# EAGLE design airball_sensor_board_v6 (EAGLE 9.4.2)

## Sheet 1 of 3
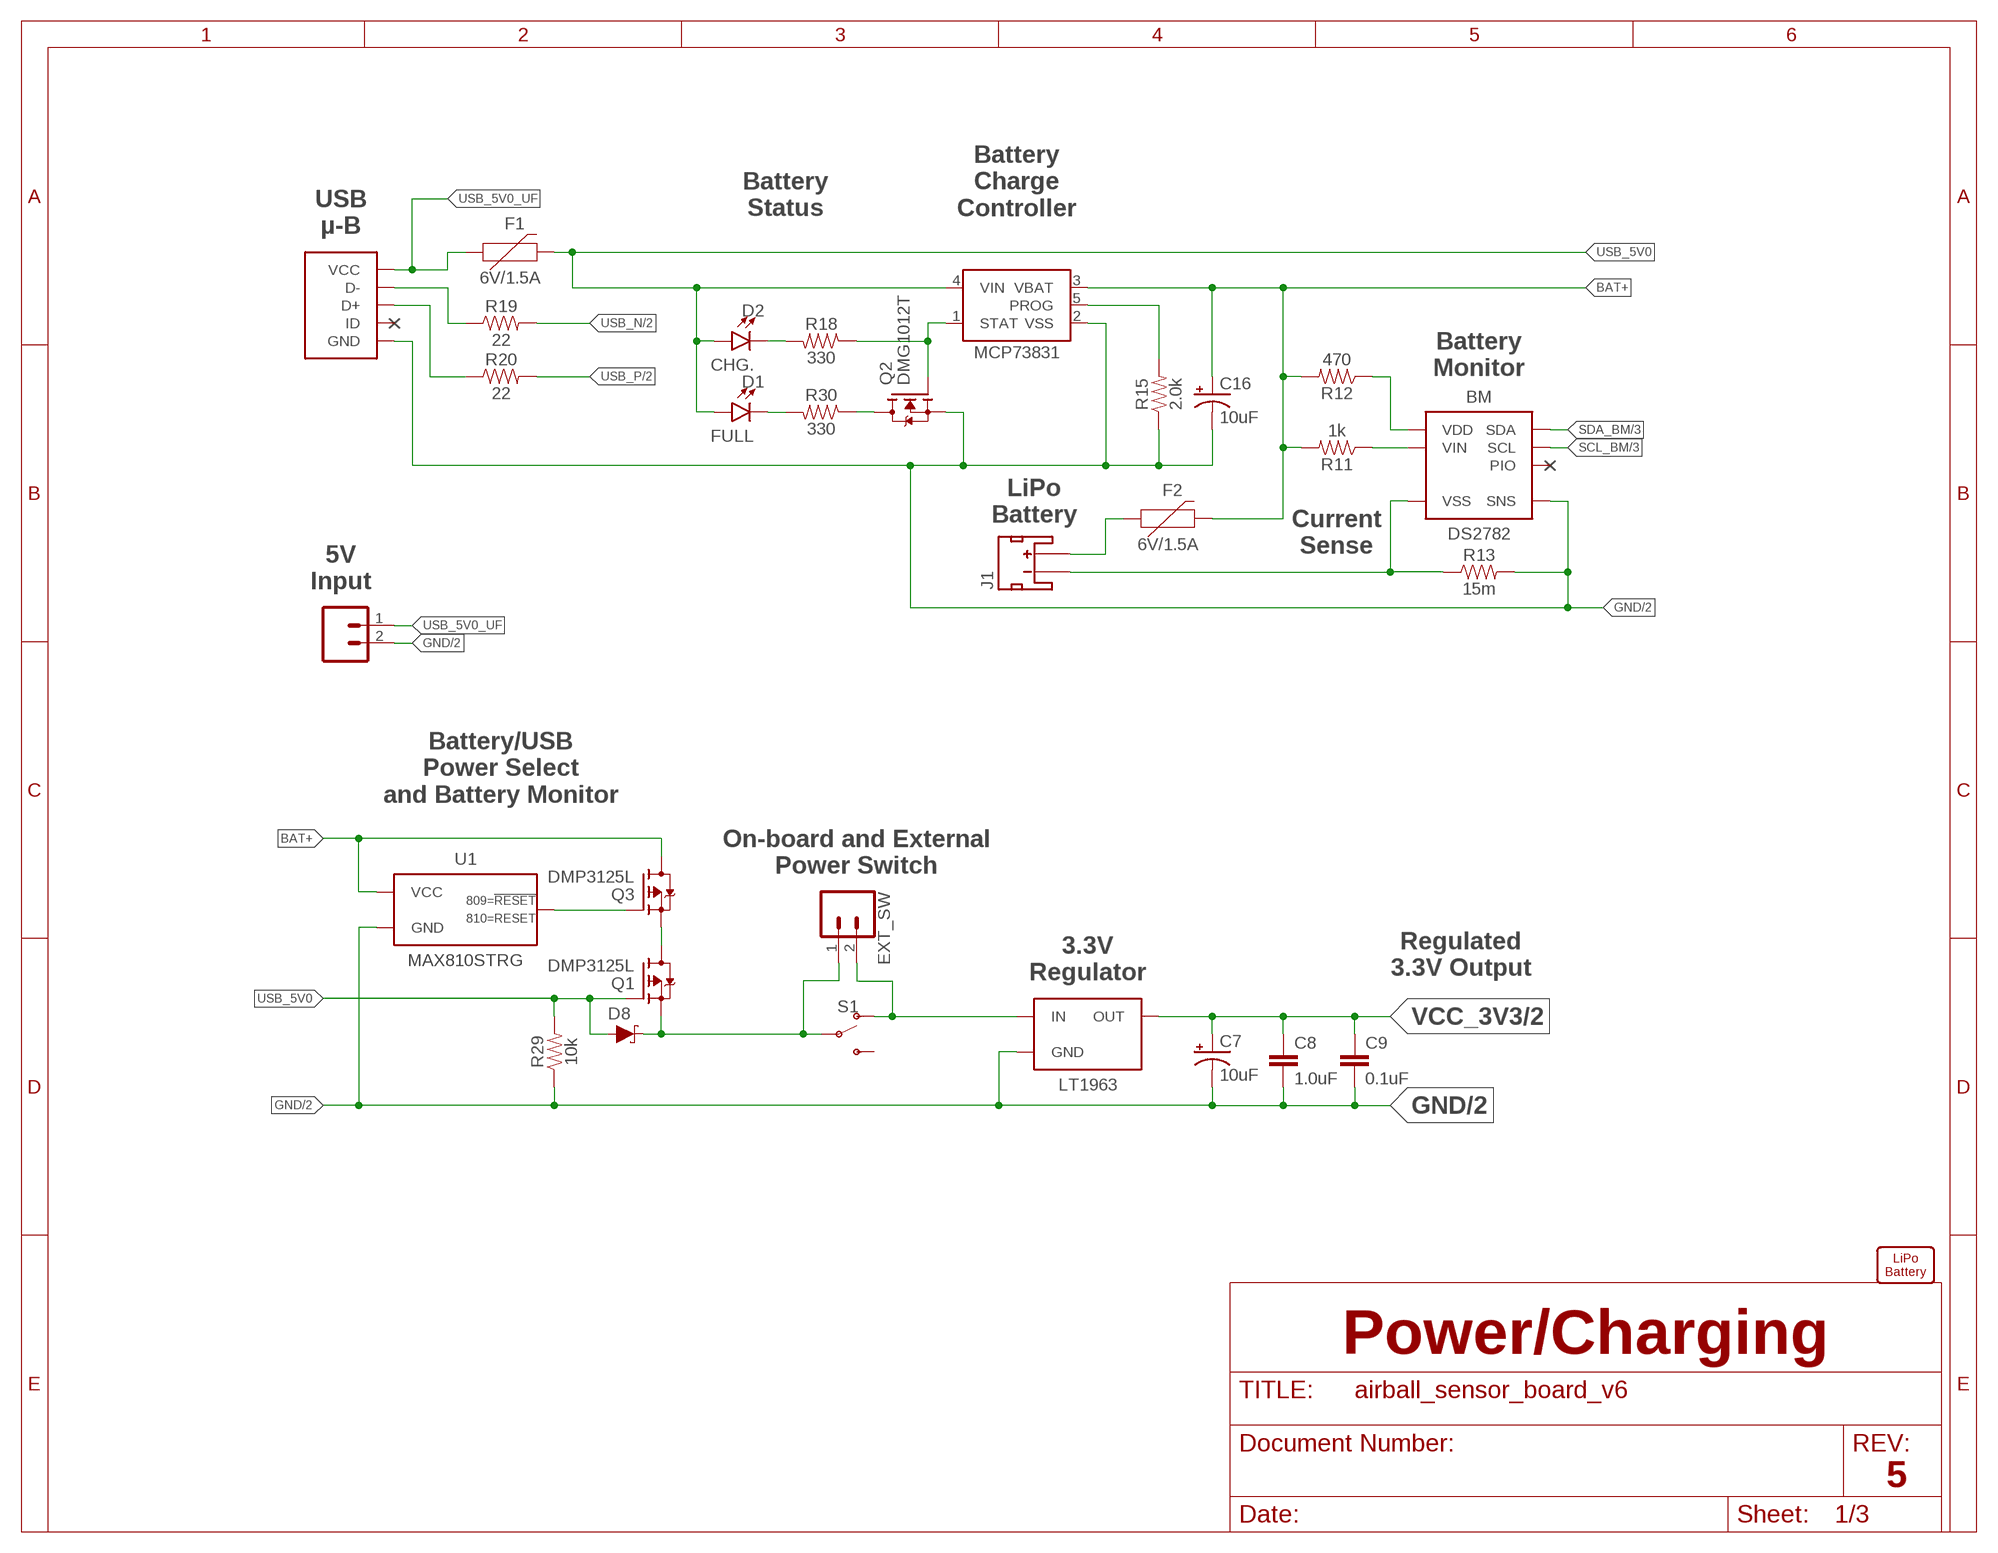
[diagram p0: schematic, sheet 1]

### Parts
BM  DS2782  [TSSOP8]
C7  10uF  10UF-POLAR-EIA3216-16V-10%(TANT)  [EIA3216]
C8  1.0uF  1.0UF-0603-16V-10%  [0603]
C9  0.1uF  0.1UF-0603-25V-5%  [0603]
C16  10uF  10UF-POLAR-EIA3216-16V-10%(TANT)  [EIA3216]
CC  MCP73831  [SOT23-5]
D1  LED0603  [LED-0603]
D2  LED0603  [LED-0603]
D8  DIODE-SCHOTTKY-BAT20J  [SOD-323]
EXT_POWER  CONN_02  [1X02]
EXT_SW  CONN_02  [1X02]
F1  6V/1.5A  PPTC_HALF-AMP  [1206]
F2  6V/1.5A  PPTC_HALF-AMP  [1206]
J1  JST_2MM_MALE  [JST-2-SMD]
JP1  USB_MICROB_PLUG  [USB_MICRO_B_TYCO]
Q1  DMP3125L  [SOT23-3]
Q2  DMG1012T  [SOT523-3]
Q3  DMP3125L  [SOT23-3]
R11  1k  1KOHM-0603-1/10W-1%  [0603]
R12  470  470OHM-0603-1/10W-1%  [0603]
R13  15m  RESISTOR1206  [1206]
R15  2.0k  2.0KOHM-0603-1/10W-5%  [0603]
R18  330  330OHM-0603-1/10W-1%  [0603]
R19  22  22OHM-0603-1/10W-1%  [0603]
R20  22  22OHM-0603-1/10W-1%  [0603]
R29  10k  10KOHM-0603-1/10W-1%  [0603]
R30  330  330OHM-0603-1/10W-1%  [0603]
S1  SWITCH-SPDT-SMD-RIGHT-ANGLE  [SWITCH_SPST_SMD_A]
U1  MAX810STRG  MAX809/810  [SOT23-3]
U$3  LIPO_BATTERY_OUTLINE-1000MAH  [SPARKFUN_LIPO_1000MAH]
VREG  LT1963  [SOT223-3]

### Nets
BAT+ [battery]: C16.+ CC.3(VBAT) F2.2 Q3.3(D) R11.2 R12.2 U1.3(VCC)
BAT+_UF [battery]: F2.1 J1.2(+)
BAT- [battery]: BM.2(VSS) J1.1(-) R13.1
BAT_LOW: Q3.1(G) U1.2(RESET)
BM_VDD [power]: BM.4(VDD) R12.1
BM_VIN [power]: BM.3(VIN) R11.1
CC_PROG: CC.5(PROG) R15.2
GND [power]: BM.7(SNS) C7.- C8.2 C9.2 C16.- CC.2(VSS) EXT_POWER.2 JP1.5(GND) JP1.SH@1(GND) JP1.SH@2(GND) JP1.SH@3(GND) JP1.SH@4(GND) Q2.3(S) R13.2 R15.1 R29.1 U1.1(GND) VREG.2(GND) VREG.TAB(GND) ; also sheet 2,3
N$1: D2.C R18.2
N$4: CC.1(STAT) Q2.1(G) R18.1
N$8 [battery]: Q1.3(D) Q3.2(S)
N$10: D1.C R30.2
N$11: Q2.2(D) R30.1
SCL_BM: BM.6(SCL) ; also sheet 3
SDA_BM: BM.5(SDA) ; also sheet 3
USB_5V0 [power]: CC.4(VIN) D1.A D2.A D8.A F1.2 Q1.1(G) R29.2
USB_5V0_UF [battery]: EXT_POWER.1 F1.1 JP1.1(VCC)
USB_N: R19.2 ; also sheet 2
USB_P: R20.2 ; also sheet 2
USB_X_N: JP1.2(D-) R19.1
USB_X_P: JP1.3(D+) R20.1
VCC_3V3 [power]: C7.+ C8.1 C9.1 VREG.3(OUT) ; also sheet 2,3
VIN [battery]: D8.C EXT_SW.1 Q1.2(S) S1.2(P)
VIN_SW [battery]: EXT_SW.2 S1.1(O) VREG.1(IN)
Unconnected: BM.8(PIO) J1.NC1(PAD1) J1.NC2(PAD2) JP1.4(ID) S1.3(S)

### Notes on the sheet
- Battery
  Status
- Battery
  Charge
  Controller
- USB
  µ-B
- ×
- CHG.
- Battery
  Monitor
- FULL
- ×
- LiPo
  Battery
- Current
  Sense
- 5V
  Input
- Battery/USB
  Power Select
  and Battery Monitor
- On-board and External
  Power Switch
- Regulated
  3.3V Output
- 3.3V
  Regulator
- Power/Charging
- 5

## Sheet 2 of 3
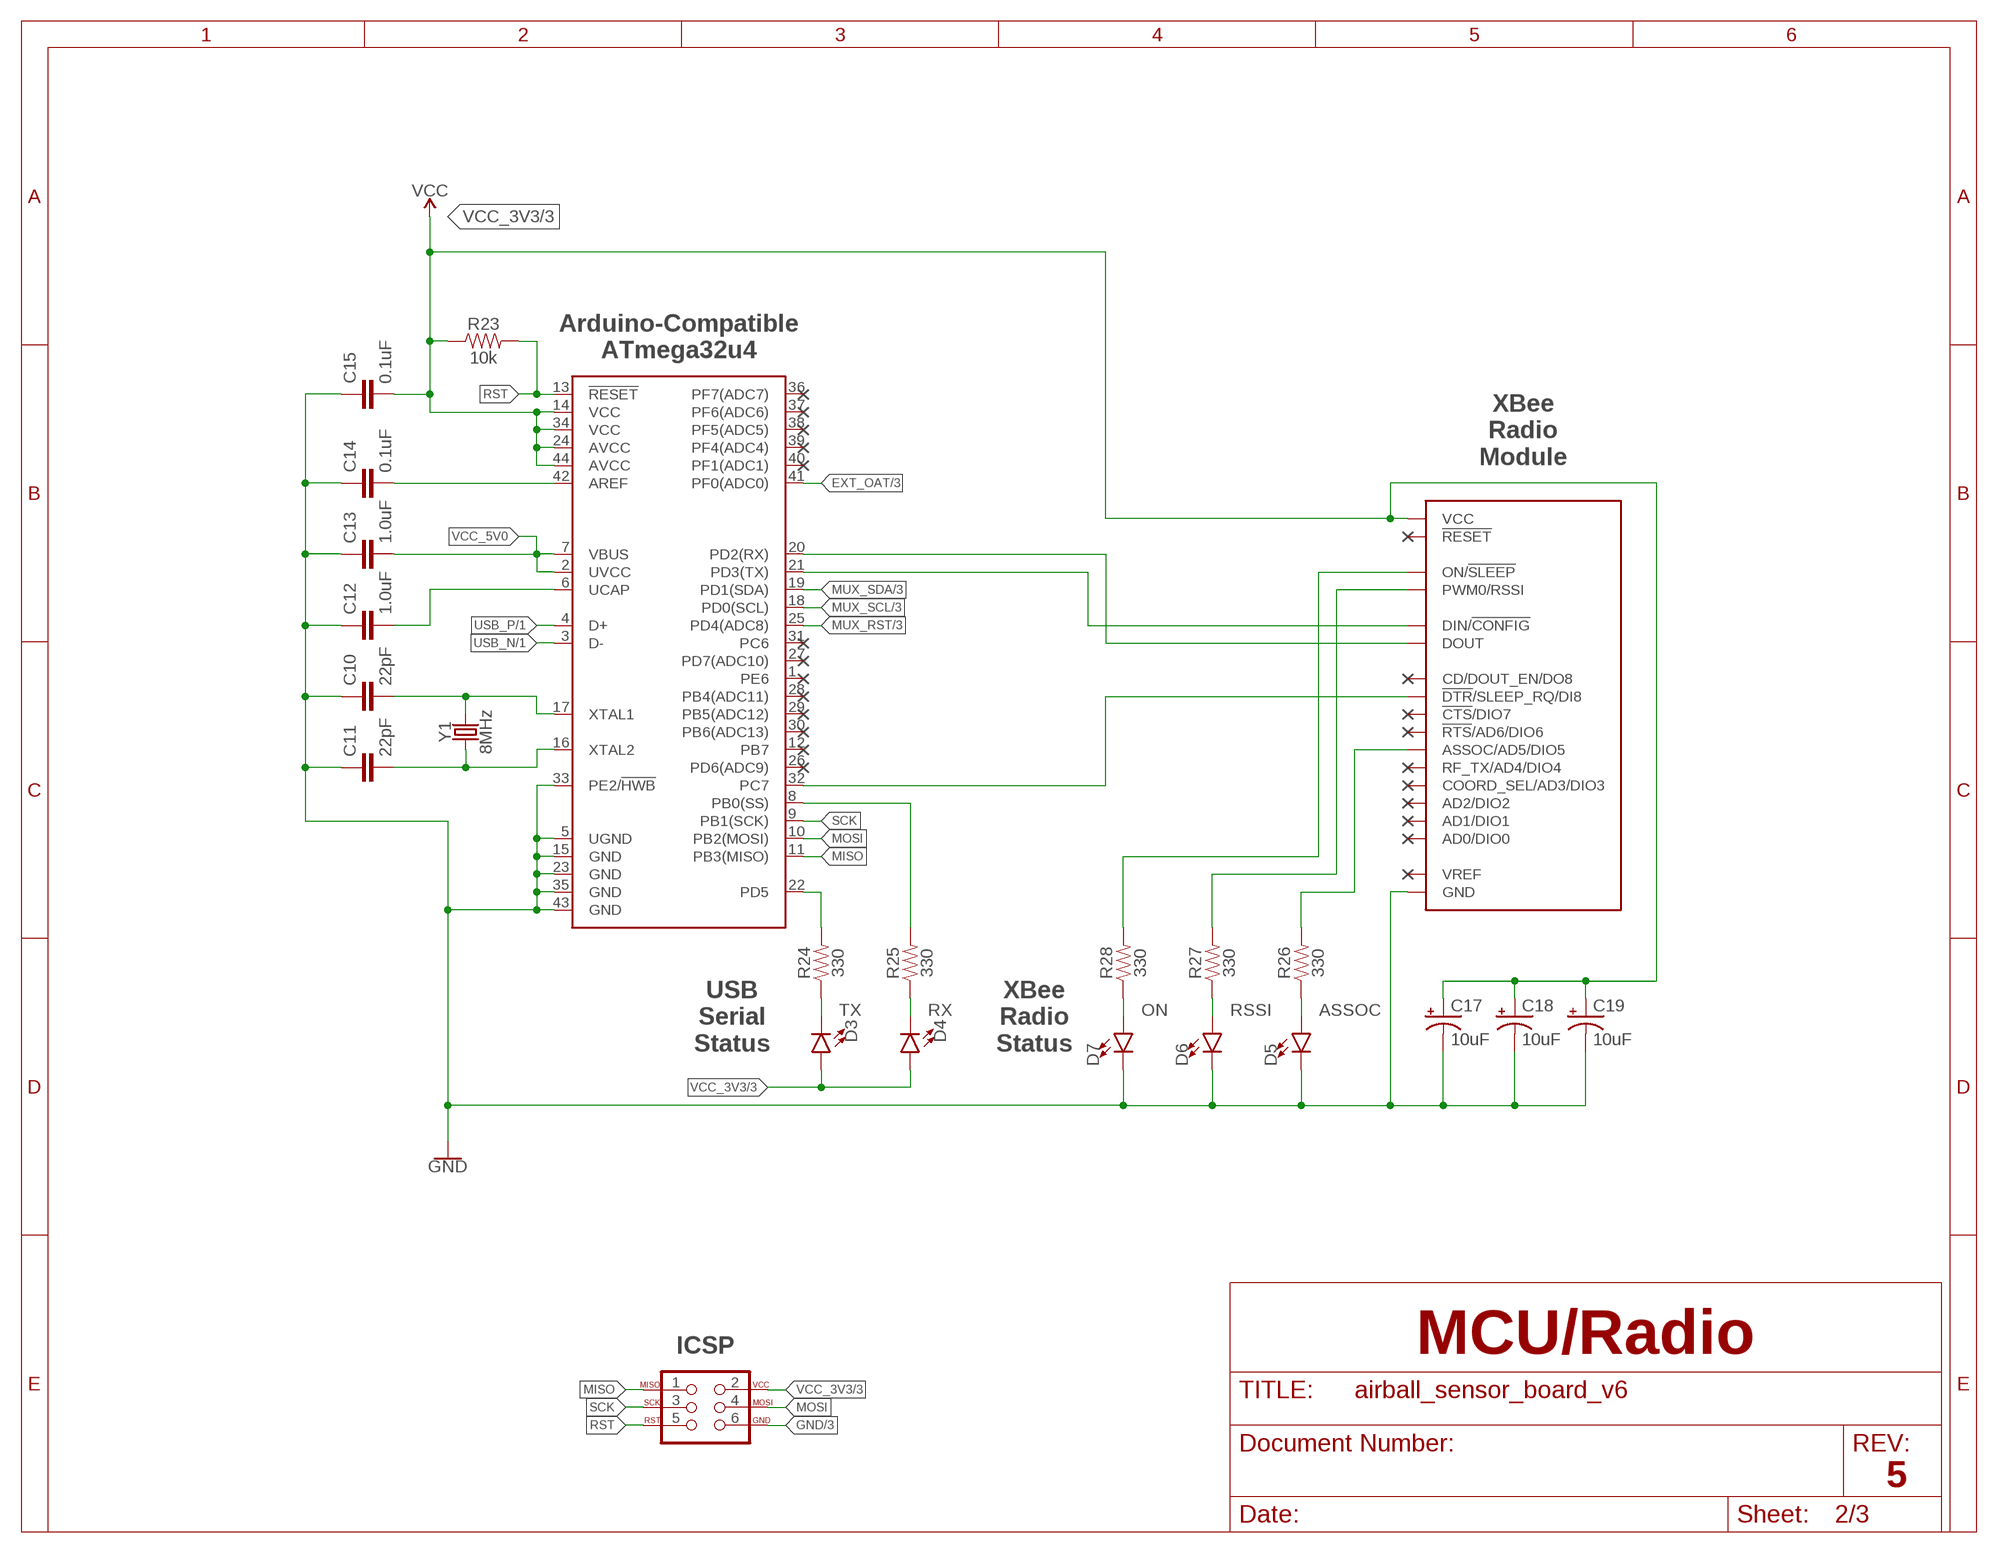
[diagram p1: schematic, sheet 2]

### Parts
C10  22pF  22PF-0603-50V-5%  [0603]
C11  22pF  22PF-0603-50V-5%  [0603]
C12  1.0uF  1.0UF-0603-16V-10%  [0603]
C13  1.0uF  1.0UF-0603-16V-10%  [0603]
C14  0.1uF  0.1UF-0603-25V-5%  [0603]
C15  0.1uF  0.1UF-0603-25V-5%  [0603]
C17  10uF  10UF-POLAR-EIA3216-16V-10%(TANT)  [EIA3216]
C18  10uF  10UF-POLAR-EIA3216-16V-10%(TANT)  [EIA3216]
C19  10uF  10UF-POLAR-EIA3216-16V-10%(TANT)  [EIA3216]
D3  LED0603  [LED-0603]
D4  LED0603  [LED-0603]
D5  LED0603  [LED-0603]
D6  LED0603  [LED-0603]
D7  LED0603  [LED-0603]
ICSP  AVR_SPI_PROG_3X2PTH  [2X3]
MCU  32U4  ATMEGA32U4TQFP-44  [TQFP44]
R23  10k  10KOHM-0603-1/10W-1%  [0603]
R24  330  330OHM-0603-1/10W-1%  [0603]
R25  330  330OHM-0603-1/10W-1%  [0603]
R26  330  330OHM-0603-1/10W-1%  [0603]
R27  330  330OHM-0603-1/10W-1%  [0603]
R28  330  330OHM-0603-1/10W-1%  [0603]
XBEE  XBEE-PRO-SMD  [XBEE-PRO-SMD]
Y1  8MHz  CRYSTAL-8MHZSMD-5X3.2  [CRYSTAL-SMD-5X3.2-4PAD]

### Nets
ASSOC_LED: R26.2 XBEE.15(ASSOC/AD5/DIO5)
EXT_OAT: MCU.41(PF0(ADC0)) ; also sheet 3
GND [power]: C10.1 C11.1 C12.1 C13.1 C14.1 C15.1 C17.- C18.- C19.- D5.C D6.C D7.C ICSP.6 MCU.5(UGND) MCU.15(GND) MCU.23(GND) MCU.33(PE2/!HWB) MCU.35(GND) MCU.43(GND) XBEE.10(GND) ; also sheet 1,3
MISO: ICSP.1 MCU.11(PB3(MISO))
MOSI: ICSP.4 MCU.10(PB2(MOSI))
MUX_RST: MCU.25(PD4(ADC8)) ; also sheet 3
MUX_SCL: MCU.18(PD0(SCL)) ; also sheet 3
MUX_SDA: MCU.19(PD1(SDA)) ; also sheet 3
N$2: D3.C R24.1
N$3: D4.C R25.1
N$6: C10.2 MCU.17(XTAL1) Y1.3
N$7: C11.2 MCU.16(XTAL2) Y1.1
N$12: C14.2 MCU.42(AREF)
N$16: C12.2 MCU.6(UCAP)
N$20: D5.A R26.1
N$21: D6.A R27.1
N$22: D7.A R28.1
ON_LED: R28.2 XBEE.13(ON/!SLEEP)
RSSI_LED: R27.2 XBEE.6(PWM0/RSSI)
RST: ICSP.5 MCU.13(!RESET) R23.2
RX_LED: MCU.8(PB0(SS)) R25.2
RXD: MCU.20(PD2(RX)) XBEE.2(DOUT)
SCK: ICSP.3 MCU.9(PB1(SCK))
SLEEP_RQ: MCU.32(PC7) XBEE.9(!DTR!/SLEEP_RQ/DI8)
TX_LED: MCU.22(PD5) R24.2
TXD: MCU.21(PD3(TX)) XBEE.3(DIN/!CONFIG)
USB_N: MCU.3(D-) ; also sheet 1
USB_P: MCU.4(D+) ; also sheet 1
VCC_3V3 [power]: C15.2 C17.+ C18.+ C19.+ D3.A D4.A ICSP.2 MCU.14(VCC) MCU.24(AVCC) MCU.34(VCC) MCU.44(AVCC) R23.1 XBEE.1(VCC) ; supply symbol labelled VCC ; also sheet 1,3
VCC_5V0 [power]: C13.2 MCU.2(UVCC) MCU.7(VBUS)
Unconnected: MCU.1(PE6) MCU.12(PB7) MCU.26(PD6(ADC9)) MCU.27(PD7(ADC10)) MCU.28(PB4(ADC11)) MCU.29(PB5(ADC12)) MCU.30(PB6(ADC13)) MCU.31(PC6) MCU.36(PF7(ADC7)) MCU.37(PF6(ADC6)) MCU.38(PF5(ADC5)) MCU.39(PF4(ADC4)) MCU.40(PF1(ADC1)) XBEE.4(CD/DOUT_EN/DO8) XBEE.5(!RESET) XBEE.11(RF_TX/AD4/DIO4) XBEE.12(!CTS!/DIO7) XBEE.14(VREF) XBEE.16(!RTS!/AD6/DIO6) XBEE.17(COORD_SEL/AD3/DIO3) XBEE.18(AD2/DIO2) XBEE.19(AD1/DIO1) XBEE.20(AD0/DIO0)

### Notes on the sheet
- Arduino-Compatible
  ATmega32u4
- ×
- ×
- ×
- ×
- ×
- XBee
  Radio
  Module
- ×
- ×
- ×
- × | ×
- ×
- × | ×
- × | ×
- ×
- × | ×
- ×
- ×
- ×
- ×
- ×
- TX | RX | ON | RSSI | ASSOC
- USB
  Serial
  Status
- XBee
  Radio
  Status
- ICSP | MCU/Radio
- 5

## Sheet 3 of 3
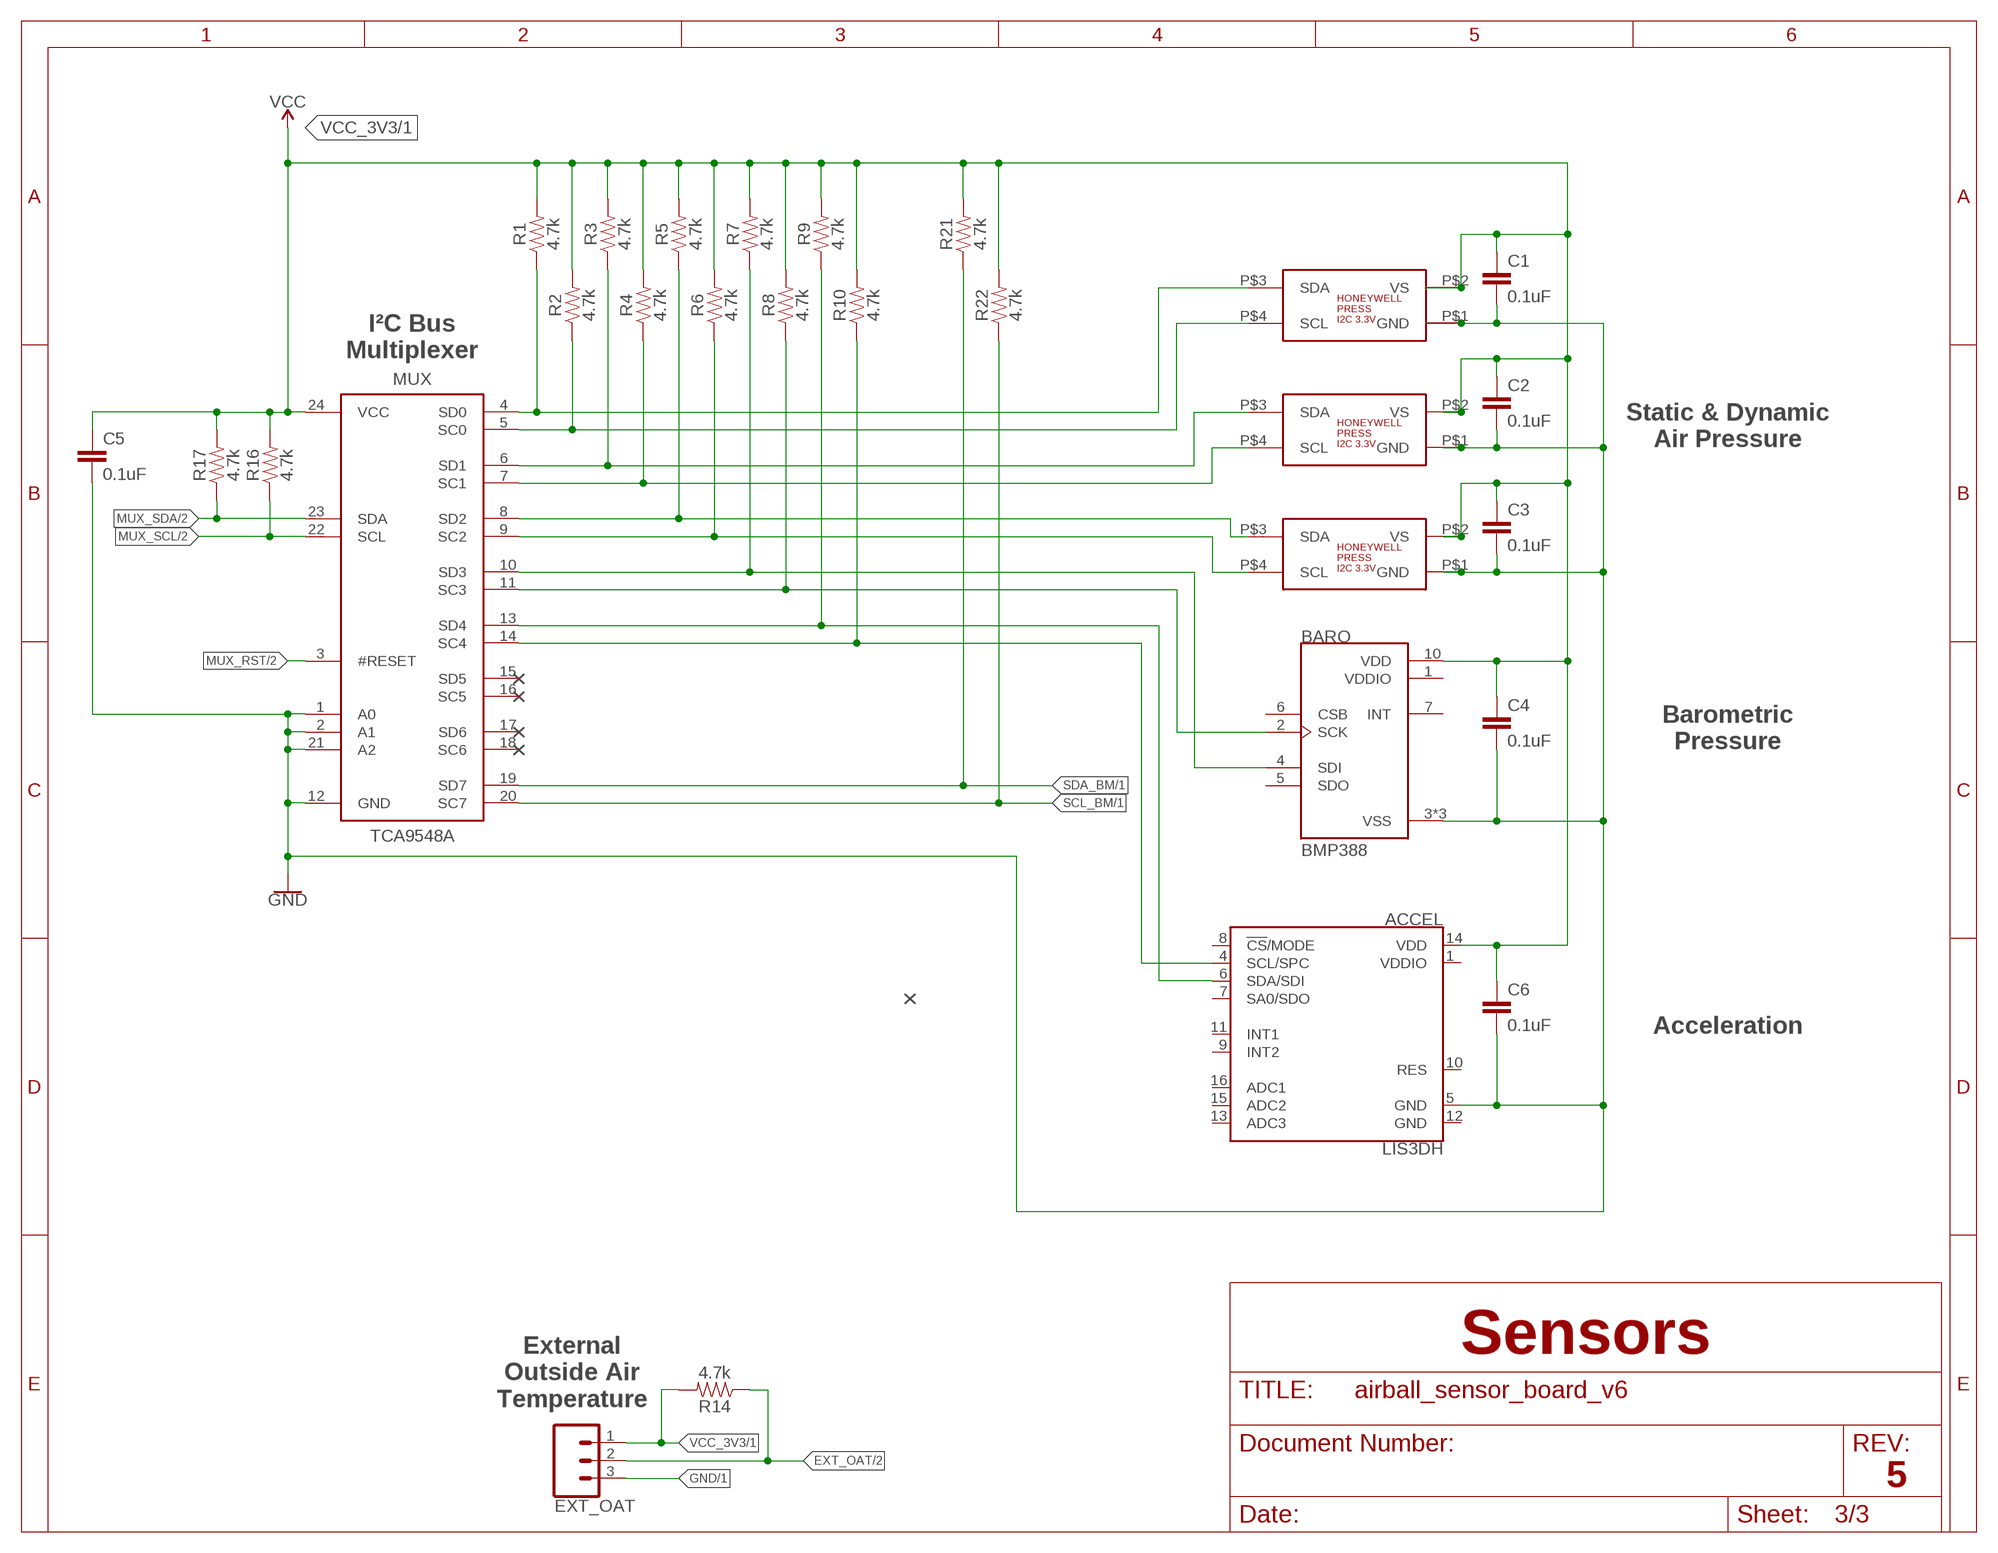
[diagram p2: schematic, sheet 3]

### Parts
ACCEL  LIS3DH  [LGA-16-3X3]
BARO  BMP388  [PQFN50P200X200X80-10N]
C1  0.1uF  0.1UF-0603-25V-5%  [0603]
C2  0.1uF  0.1UF-0603-25V-5%  [0603]
C3  0.1uF  0.1UF-0603-25V-5%  [0603]
C4  0.1uF  0.1UF-0603-25V-5%  [0603]
C5  0.1uF  0.1UF-0603-25V-5%  [0603]
C6  0.1uF  0.1UF-0603-25V-5%  [0603]
DP0  HONEYWELL_TRUSTABILITY_I2C_3.3V  [HONEYWELL_TRUSTABILITY_DIP_RR]
DPA  HONEYWELL_TRUSTABILITY_I2C_3.3V  [HONEYWELL_TRUSTABILITY_DIP_RR]
DPB  HONEYWELL_TRUSTABILITY_I2C_3.3V  [HONEYWELL_TRUSTABILITY_DIP_RR]
EXT_OAT  CONN_03  [1X03]
MUX  TCA9548A  TCA9548ATSSOP24  [TSSOP24]
R1  4.7k  4.7KOHM-0603-1/10W-1%  [0603]
R2  4.7k  4.7KOHM-0603-1/10W-1%  [0603]
R3  4.7k  4.7KOHM-0603-1/10W-1%  [0603]
R4  4.7k  4.7KOHM-0603-1/10W-1%  [0603]
R5  4.7k  4.7KOHM-0603-1/10W-1%  [0603]
R6  4.7k  4.7KOHM-0603-1/10W-1%  [0603]
R7  4.7k  4.7KOHM-0603-1/10W-1%  [0603]
R8  4.7k  4.7KOHM-0603-1/10W-1%  [0603]
R9  4.7k  4.7KOHM-0603-1/10W-1%  [0603]
R10  4.7k  4.7KOHM-0603-1/10W-1%  [0603]
R14  4.7k  4.7KOHM-0603-1/10W-1%  [0603]
R16  4.7k  4.7KOHM-0603-1/10W-1%  [0603]
R17  4.7k  4.7KOHM-0603-1/10W-1%  [0603]
R21  4.7k  4.7KOHM-0603-1/10W-1%  [0603]
R22  4.7k  4.7KOHM-0603-1/10W-1%  [0603]

### Nets
EXT_OAT: EXT_OAT.2 R14.1 ; also sheet 2
GND [power]: ACCEL.5(GND) BARO.3(VSS) BARO.8(VSS) BARO.9(VSS) C1.2 C2.2 C3.2 C4.2 C5.2 C6.2 DP0.P$1(GND) DPA.P$1(GND) DPB.P$1(GND) EXT_OAT.3 MUX.1(A0) MUX.2(A1) MUX.12(GND) MUX.21(A2) ; also sheet 1,2
MUX_RST: MUX.3(#RESET) ; also sheet 2
MUX_SCL: MUX.22(SCL) R16.1 ; also sheet 2
MUX_SDA: MUX.23(SDA) R17.1 ; also sheet 2
SCL_ACCEL: ACCEL.4(SCL/SPC) MUX.14(SC4) R10.1
SCL_BM: MUX.20(SC7) R22.1 ; also sheet 1
SCL_BMP_BARO: BARO.2(SCK) MUX.11(SC3) R8.1
SCL_DP0: DP0.P$4(SCL) MUX.5(SC0) R2.1
SCL_DPA: DPA.P$4(SCL) MUX.7(SC1) R4.1
SCL_DPB: DPB.P$4(SCL) MUX.9(SC2) R6.1
SDA_ACCEL: ACCEL.6(SDA/SDI) MUX.13(SD4) R9.1
SDA_BM: MUX.19(SD7) R21.1 ; also sheet 1
SDA_BMP_BARO: BARO.4(SDI) MUX.10(SD3) R7.1
SDA_DP0: DP0.P$3(SDA) MUX.4(SD0) R1.1
SDA_DPA: DPA.P$3(SDA) MUX.6(SD1) R3.1
SDA_DPB: DPB.P$3(SDA) MUX.8(SD2) R5.1
VCC_3V3 [power]: ACCEL.14(VDD) BARO.10(VDD) C1.1 C2.1 C3.1 C4.1 C5.1 C6.1 DP0.P$2(VS) DPA.P$2(VS) DPB.P$2(VS) EXT_OAT.1 MUX.24(VCC) R1.2 R2.2 R3.2 R4.2 R5.2 R6.2 R7.2 R8.2 R9.2 R10.2 R14.2 R16.2 R17.2 R21.2 R22.2 ; supply symbol labelled VCC ; also sheet 1,2
Unconnected: ACCEL.1(VDDIO) ACCEL.7(SA0/SDO) ACCEL.8(!CS!/MODE) ACCEL.9(INT2) ACCEL.10(RES) ACCEL.11(INT1) ACCEL.12(GND) ACCEL.13(ADC3) ACCEL.15(ADC2) ACCEL.16(ADC1) BARO.5(SDO) BARO.6(CSB) BARO.7(INT) MUX.15(SD5) MUX.16(SC5) MUX.17(SD6) MUX.18(SC6)

### Notes on the sheet
- I²C Bus
  Multiplexer
- Static & Dynamic
  Air Pressure
- ×
- ×
- ×
- ×
- Barometric
  Pressure
- ×
- Acceleration
- Sensors
- External
  Outside Air
  Temperature
- 5

## Power pins joined to a net without a drawn wire
VDDIO: BARO.1(VDDIO)

## Library data of the parts
ACCEL = SparkFun-Sensors:LIS3DH: ST Microelectronics LIS3DH 3-Axis ±2/4/8/16g SPI/I2C Accelerometer The LIS3DH is a three axis MEMS linear accelerometer in the "nano" family. It has a digital I2C/SPI serial interface which makes it ideal for using in embedded applications. The device also features ultra low-power operational modes that allow advanced power saving and smart sleep to wake-up functions, built in detections with interrupts, and auxiliary ADC inputs Datasheet-XXXX <http://www.sparkfun.com/datasheets/Sensors/Accelerometer/LIS3DH.pdf> SparkFun Products SparkFun Triple Axis Accelerometer Breakout - LIS3DH <https://www.sparkfun.com/products/10345> (SEN-XXXXX) Triple Axis Accelerometer - LIS3DH <https://www.sparkfun.com/products/9755> (SEN-XXXXX); PROD_ID: IC-13419; SF_ID: N/A
BARO = BMP388:BMP388: P-Sensor SPI I2C 1, 25 Bar SMD; AVAILABILITY: Unavailable; DESCRIPTION: P-Sensor SPI I2C 1, 25 Bar SMD; MF: Bosch Sensortec; MP: BMP388; PACKAGE: WFLGA-10 Bosch Tools; PRICE: None
BM = airball:DS2782
C1-C6 C9 C14 C15 = SparkFun-Capacitors:0.1UF: 0.1µF ceramic capacitors A capacitor is a passive two-terminal electrical component used to store electrical energy temporarily in an electric field.; PROD_ID: CAP-08604
C7 C16-C19 = SparkFun-Capacitors:10UF-POLAR: 10.0µF polarized capacitors A capacitor is a passive two-terminal electrical component used to store electrical energy temporarily in an electric field.; PROD_ID: CAP-00811
C8 C12 C13 = SparkFun-Capacitors:1.0UF: 1µF ceramic capacitors A capacitor is a passive two-terminal electrical component used to store electrical energy temporarily in an electric field.; PROD_ID: CAP-00868
C10 C11 = SparkFun-Capacitors:22PF: 22pF ceramic capacitors A capacitor is a passive two-terminal electrical component used to store electrical energy temporarily in an electric field.; PROD_ID: CAP-07876
CC = SparkFun-IC-Power:MCP73831: MCP73831T Li-Ion, Li-Pol Controller Miniature single cell, fully integrated Li-Ion, Li-polymer charge management controller Datasheet <http://ww1.microchip.com/downloads/en/DeviceDoc/20001984g.pdf> SparkFun Products: SparkFun ESP32 Thing <https://www.sparkfun.com/products/13907> SparkFun 9DoF Razor IMU M0 <https://www.sparkfun.com/products/14001>; PROD_ID: IC-09995
D1-D7 = SparkFun-LED:LED: LED (Generic) Standard schematic elements and footprints for 5mm, 3mm, 1206, and 0603 sized LEDs. Generic LEDs with no color specified.
D8 = SparkFun-DiscreteSemi:DIODE-SCHOTTKY: Schottky diode A Schottky diode is a semiconductor diode which has a low forward voltage drop and a very fast switching action.; PROD_ID: DIO-11623; VALUE: 1A/23V/620mV
DP0 DPA DPB = airball:HONEYWELL_TRUSTABILITY_I2C_3.3V
EXT_OAT = SparkFun-Connectors:CONN_03: Multi connection point. Often used as Generic Header-pin footprint for 0.1 inch spaced/style header connections On any of the 0.1 inch spaced packages, you can populate with these: Break Away Headers - Straight <https://www.sparkfun.com/products/116> (PRT-00116) Break Away Male Headers - Right Angle <https://www.sparkfun.com/products/553> (PRT-00553) Female Headers <https://www.sparkfun.com/products/115> (PRT-00115) Break Away Headers - Machine Pin <https://www.sparkfun.com/products/117> (PRT-00117) Break Away Female Headers - Swiss Machine Pin <https://www.sparkfun.com/products/743> (PRT-00743) Stackable Header - 3 Pin (Female, 0.1") <https://www.sparkfun.com/products/13875> (PRT-13875) For SCREWTERMINALS and SPRING TERMINALS visit here: Screw Terimnals on SparkFun.com <https://www.sparkfun.com/search/results?term=Screw+Terminals> (5mm/3.5mm/2.54mm spacing) This device is also useful as a general connection point to wire up your design to another part of your project. Our various solder wires solder well into these plated through hole pads. Hook-Up Wire - Assortment (Stranded, 22 AWG) <https://www.sparkfun.com/products/11375> (PRT-11375) Hook-Up Wire - Assortment (Solid Core, 22 AWG) <https://www.sparkfun.com/products/11367> (PRT-11367) View the entire wire category on our website here <https://www.sparkfun.com/categories/141> Special notes: Molex polarized connector foot print use with SKU : PRT-08232 with associated crimp pins and housings.; PROD_ID: XXX-00000; VALUE: 455-1750-1-ND
EXT_POWER EXT_SW = SparkFun-Connectors:CONN_02: Multi connection point. Often used as Generic Header-pin footprint for 0.1 inch spaced/style header connections On any of the 0.1 inch spaced packages, you can populate with these: Break Away Headers - Straight <https://www.sparkfun.com/products/116> (PRT-00116) Break Away Male Headers - Right Angle <https://www.sparkfun.com/products/553> (PRT-00553) Female Headers <https://www.sparkfun.com/products/115> (PRT-00115) Break Away Headers - Machine Pin <https://www.sparkfun.com/products/117> (PRT-00117) Break Away Female Headers - Swiss Machine Pin <https://www.sparkfun.com/products/743> (PRT-00743) For SCREWTERMINALS and SPRING TERMINALS visit here: Screw Terimnals on SparkFun.com <https://www.sparkfun.com/search/results?term=Screw+Terminals> (5mm/3.5mm/2.54mm spacing) This device is also useful as a general connection point to wire up your design to another part of your project. Our various solder wires solder well into these plated through hole pads. Hook-Up Wire - Assortment (Stranded, 22 AWG) <https://www.sparkfun.com/products/11375> (PRT-11375) Hook-Up Wire - Assortment (Solid Core, 22 AWG) <https://www.sparkfun.com/products/11367> (PRT-11367) View the entire wire category on our website here <https://www.sparkfun.com/categories/141> Special notes: Molex polarized connector foot print use with: PRT-08233 with associated crimp pins and housings. 2.54_SCREWTERM for use with PRT-10571. 3.5mm Screw Terminal footprints for PRT-08084 5mm Screw Terminal footprints for use with PRT-08432
F1 F2 = SparkFun-Fuses:PPTC: Resettable Fuse PPTC Resettable Fuse. Really a sort of resistor with a polymeric positive temperature coefficient whose resistance increases dramatically with an increase in temperature. When heated by the power passing through the resistance rises causing the current to be limited, protecting the circuit. This is achieved by the transition of the polymer from a crystalline to an amorphous state where the conductive carbon separates breaking the conductive pathways found in the cool crystalline structure. When a PPTC cools back down it resumes conducting letting the circuit turn back on. SparkFun Products: SparkFun RedBoard - Programmed with Arduino <https://www.sparkfun.com/products/12757> Pro Micro - 5V/16MHz <https://www.sparkfun.com/products/12640> Arduino Pro 328 - 5V/16MHz <https://www.sparkfun.com/products/10915> MP3 Trigger <https://www.sparkfun.com/products/13720>; PROD_ID: RES-08585; VALUE: 6V/0.5A
ICSP = SparkFun-Connectors:AVR_SPI_PROG_3X2: AVR ISP 6 Pin This is the reduced ISP connector for AVR programming. Common on Arduino. This footprint will take up less PCB space and can be used with a 10-pin to 6-pin adapter such as SKU: BOB-08508 **Special note about "TEST_POINT" package. The stop mask is on the top side, so if you want your programming test points to be on the bottom of your board, make sure to place this package on the bottom side of the board. This also ensure that the orientation to program from the bottom side will be correct. SparkFun Products: SparkFun ISP Pogo Adapter <https://www.sparkfun.com/products/11591> - NS Tiny AVR Programmer <https://www.sparkfun.com/products/11801> -PTH
J1 = SparkFun-Connectors:JST_2MM_MALE: JST 2MM MALE RA CONNECTOR Two pin, compact surface mount connector. Commonly used as a battery input connection point. We really like the solid locking feeling and high current rating on these small connectors. We use these all the time as battery connectors. Mates to single-cell LiPo batteries. Here is the connector we sell at SparkFun: JST Right Angle Connector - White <https://www.sparkfun.com/products/8612> (PRT-08612) Datasheet <http://www.sparkfun.com/datasheets/Prototyping/Connectors/JST-Horizontal.pdf> It was used on these SparkFun products: SparkFun MOSFET Power Controller <https://www.sparkfun.com/products/11214> (PRT-11214) SparkFun Battery Babysitter - LiPo Battery Manager <https://www.sparkfun.com/products/13777> (PRT-13777) And many, many others that required a lipo battery connection.; PROD_ID: CONN-11443; SF_ID: PRT-08612
JP1 = airball:USB_MICROB_PLUG: USB Micro-B Plug Comes in a variety of packages. Check out Hirose's ZX-x0 line: http://www.hirose.co.jp/cataloge_hp/e24200011.pdf
MCU = jcole:ATMEGA32U4: Atmel MCU, 32KByte Atmel 44-pin 8-bit Microcontroller with 32KBytes of ISP Flash and USB Controller Datasheet <http://cdn.sparkfun.com/datasheets/Dev/Arduino/Boards/ATMega32U4.pdf> SparkFun Products LilyPad Arduino USB - ATmega32U4 Board <https://www.sparkfun.com/products/12049> (DEV-12049) Pro Micro - 5V/16MHz <https://www.sparkfun.com/products/12640> (DEV-12640) Pro Micro - 3.3V/8MHz <https://www.sparkfun.com/products/12587> (DEV-12587) Fio v3 - ATmega32U4 <https://www.sparkfun.com/products/11520> (DEV-11520) Qduino Mini <https://www.sparkfun.com/products/13614> (DEV-13614) Makey Makey - Standard Kit <https://www.sparkfun.com/products/11511> (WIG-11511) Makey Makey Deluxe Kit <https://www.sparkfun.com/products/11519> (WIG-11519); PROD_ID: IC-11161
MUX = airball:TCA9548A: Texas Instruments TCA9548A 1-to-8 I2C multiplexer. Supported packages: TSSOP24
Q1 Q3 = airball:DMP3125L
Q2 = airball:DMG1012T
R1-R10 R14 R16 R17 R21 R22 = SparkFun-Resistors:4.7KOHM: 4.7kΩ resistor A resistor is a passive two-terminal electrical component that implements electrical resistance as a circuit element. Resistors act to reduce current flow, and, at the same time, act to lower voltage levels within circuits. - Wikipedia; PROD_ID: RES-07857
R11 = SparkFun-Resistors:1KOHM: 1kΩ resistor A resistor is a passive two-terminal electrical component that implements electrical resistance as a circuit element. Resistors act to reduce current flow, and, at the same time, act to lower voltage levels within circuits. - Wikipedia; PROD_ID: RES-07856
R12 = SparkFun-Resistors:470OHM: 470Ω resistor A resistor is a passive two-terminal electrical component that implements electrical resistance as a circuit element. Resistors act to reduce current flow, and, at the same time, act to lower voltage levels within circuits. - Wikipedia; PROD_ID: RES-07869
R13 = SparkFun-Resistors:RESISTOR: Generic Resistor Package
R15 = SparkFun-Resistors:2.0KOHM: 2kΩ resistor A resistor is a passive two-terminal electrical component that implements electrical resistance as a circuit element. Resistors act to reduce current flow, and, at the same time, act to lower voltage levels within circuits. - Wikipedia; PROD_ID: RES-08296
R18 R24-R28 R30 = SparkFun-Resistors:330OHM: 330Ω resistor A resistor is a passive two-terminal electrical component that implements electrical resistance as a circuit element. Resistors act to reduce current flow, and, at the same time, act to lower voltage levels within circuits. - Wikipedia; PROD_ID: RES-00818
R19 R20 = SparkFun-Resistors:22OHM: 22Ω resistor A resistor is a passive two-terminal electrical component that implements electrical resistance as a circuit element. Resistors act to reduce current flow, and, at the same time, act to lower voltage levels within circuits. - Wikipedia; PROD_ID: RES-08698
R23 R29 = SparkFun-Resistors:10KOHM: 10kΩ resistor A resistor is a passive two-terminal electrical component that implements electrical resistance as a circuit element. Resistors act to reduce current flow, and, at the same time, act to lower voltage levels within circuits. - Wikipedia; PROD_ID: RES-00824
S1 = SparkFun-Switches:SWITCH-SPDT: Single Pole, Double Throw (SPDT) Switch Single-pole, double-throw (SPDT) switch. Variant Overview SMD-AYZ0202 Surface Mount DPDT Switch <https://www.sparkfun.com/products/597> (COM-00597) Used on e.g. LilyPad Arduino USB - ATmega32U4 Board <https://www.sparkfun.com/products/12049> PTH-11.6X4.0MM SPDT Mini Power Switch <https://www.sparkfun.com/products/102> (COM-00102) Used on e.g. SparkFun Simon Says - Through-Hole Soldering Kit <https://www.sparkfun.com/products/10547> (KIT-10547) PTH-11.6X4.0MM-KIT KIT version of SPDT Mini Power Switch - Simplifies soldering by removing tStop of switch pins - only one side can be soldered. PTH-11.6X4.0MM-LOCK LOCK version of SPDT Mini Power Switch - Offset pins hold switch in place for easier soldering. SMD-RIGHT-ANGLE Surface Mount Right Angle Switch <https://www.sparkfun.com/products/10860> (COM-10860) Used on e.g. SparkFun ESP8266 Thing <https://www.sparkfun.com/products/13231>; PROD_ID: SWCH-10651; SF_SKU: COM-10860
U1 = airball:MAX809/810
U$3 = airball:LIPO_BATTERY_OUTLINE
VREG = airball:LT1963
XBEE = airball:XBEE: XBee (TM) /XBee-PRO(TM) OEM RF Modules Source: MaxStream, Inc. xbee_productmanual.pdf
Y1 = SparkFun-Clocks:CRYSTAL-8MHZ: 8MHz Crystal Datasheet Example <http://www.futureelectronics.com/en/technologies/electromechanical/timing-devices/crystals/Pages/6008189-ABM3B-8.000MHZ-B2-T.aspx?IM=0> Frequency: 8MHz Frequency Tolerance: ±20ppm Load Capacitance: 18pF SparkFun Products: Pro Micro -3.3V/8MHz <https://www.sparkfun.com/products/12587> WAV Trigger <https://www.sparkfun.com/products/13660>; PROD_ID: XTAL-09431

## Net classes
0 signal: width 0.152 mm
1 power: width 0.305 mm
2 battery: width 0.381 mm

## Board
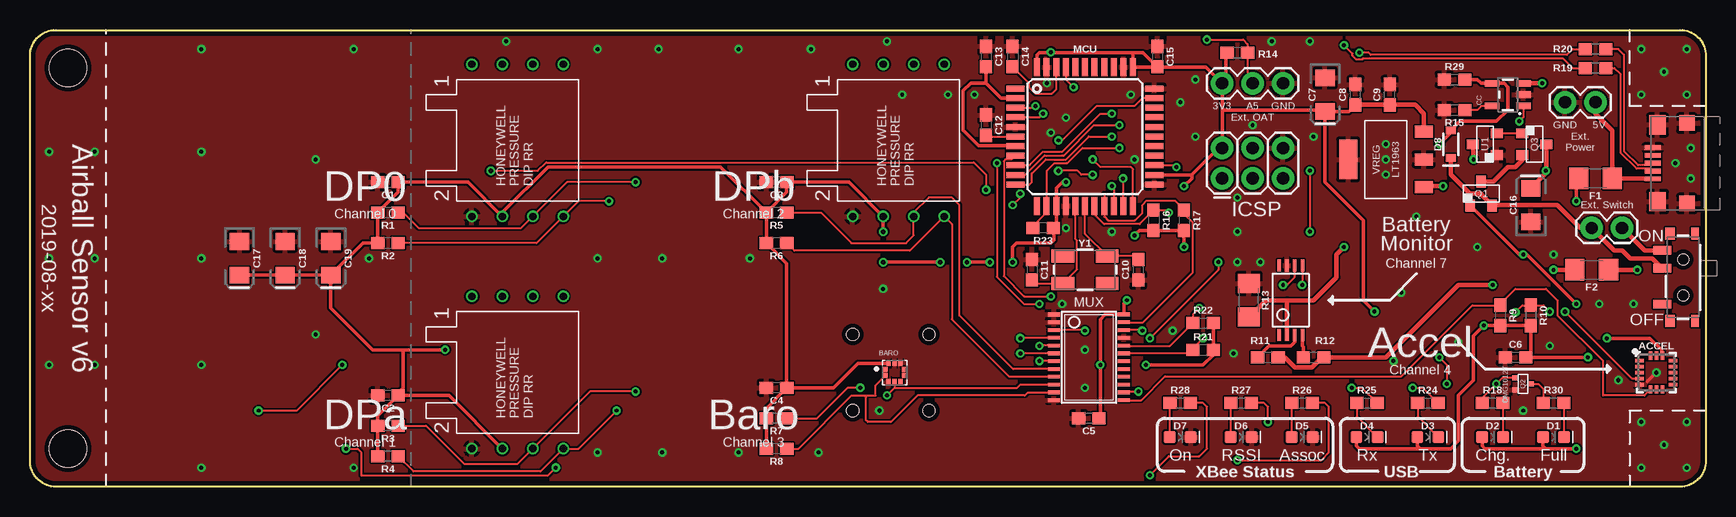
[diagram p3: board, top side]
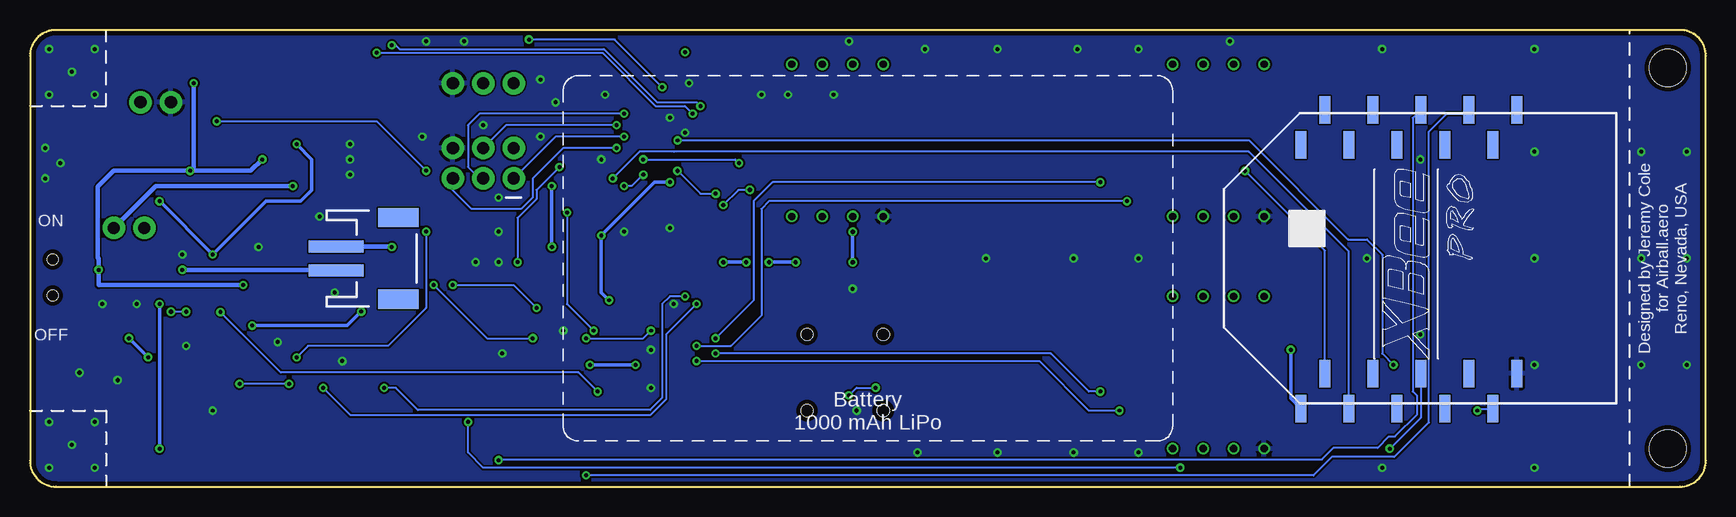
[diagram p4: board, bottom side, seen from below]

Size 139.7 x 38.1 mm. Coordinates in mm from the lower left corner, seen from the top.
Outline: 2.17,38.1 137.53,38.1 arc-90 139.7,35.93 139.7,2.17 arc-90 137.53,0 2.17,0 arc-90 0,2.17 0,35.93 arc-90 2.17,38.1
Copper layers (1*16): Top 0.0356mm / dielectric 1.5011mm / Bottom 0.0356mm
Design rules "oshpark-2layer *": minimum track width 6mil, minimum drill 13mil, track to track 6mil, track to pad 6mil, pad to pad 6mil, via to via 6mil, smd to smd 6mil, copper to edge 15mil, drill to drill 6mil, minimum pad ring 7mil, minimum via ring 7mil, stop-mask expansion 2.5mil, vias tented up to drill 15mil, thermal gap 10mil
Holes 3.1 mm at 3.17,34.92 3.17,3.17
Holes 1 mm at 74.93,12.7 68.58,12.7 68.58,6.35 74.93,6.35

### Footprints (pad centres in the part's own frame; a part is rotated, then mirrored left to right if it is on the bottom)
LGA-16-3X3 = smd 0.7 x 0.28: 1 -1.4,1; 2 -1.4,0.5; 3 -1.4,0; 4 -1.4,-0.5; 5 -1.4,-1; 9 1.4,-1; 10 1.4,-0.5; 11 1.4,0; 12 1.4,0.5; 13 1.4,1 | smd 0.28 x 0.7: 6 -0.5,-1.4; 7 0,-1.4; 8 0.5,-1.4; 14 0.5,1.4; 15 0,1.4; 16 -0.5,1.4
PQFN50P200X200X80-10N = smd 0.35 x 0.38: 1 -0.765,0.25; 2 -0.765,-0.25; 3 -0.5,-0.765; 4 0,-0.765; 5 0.5,-0.765; 6 0.765,-0.25; 7 0.765,0.25; 8 0.5,0.765; 9 0,0.765; 10 -0.5,0.765
TSSOP8 = smd 0.3 x 1: 1 -0.975,-2.9; 2 -0.325,-2.9; 3 0.325,-2.9; 4 0.975,-2.9; 5 0.975,2.9; 6 0.325,2.9; 7 -0.325,2.9; 8 -0.975,2.9
0603 = smd 1.1 x 1: 1 -0.85,0; 2 0.85,0
EIA3216 = smd 1.4 x 1.6: + 1.4,0; - -1.4,0
SOT23-5 = smd 0.55 x 1.2: 1 -0.95,-1.3; 2 0,-1.3; 3 0.95,-1.3; 4 0.95,1.3; 5 -0.95,1.3
LED-0603 = smd 1 x 1: A -0.877,0; C 0.877,0
SOD-323 = smd 0.63 x 0.83: A 1.15,0; C -1.15,0
HONEYWELL_TRUSTABILITY_DIP_RR = drill 0.6: P$1 -6.35,3.81; P$2 -6.35,1.27; P$3 -6.35,-1.27; P$4 -6.35,-3.81; P$5 6.35,-3.81; P$6 6.35,-1.27; P$7 6.35,1.27; P$8 6.35,3.81
1X03 = drill 1.016 pad 1.88: 1 0,0; 2 2.54,0; 3 5.08,0
1X02 = drill 1.016 pad 1.88: 1 0,0; 2 2.54,0
1206 = smd 1.6 x 1.8: 1 -1.4,0; 2 1.4,0
2X3 = drill 1.016 pad 1.88: 1 0,0; 2 0,2.54; 3 2.54,0; 4 2.54,2.54; 5 5.08,0; 6 5.08,2.54
JST-2-SMD = smd 1 x 4.6: 1 -1,-3.7; 2 1,-3.7 | smd 1.6 x 3.4: NC1 -3.4,1.5; NC2 3.4,1.5
USB_MICRO_B_TYCO = smd 0.4 x 1.35: 1 -1.3,2.85; 2 -0.65,2.85; 3 0,2.85; 4 0.65,2.85; 5 1.3,2.85 | smd 1.3 x 1.3: SH@1 3.35,0; SH@2 -3.35,0 | smd 1.6 x 1.4: SH@3 3.2,2.45; SH@4 -3.2,2.45
TQFP44 = smd 1.5 x 0.5: 1 -5.8,4; 2 -5.8,3.2; 3 -5.8,2.4; 4 -5.8,1.6; 5 -5.8,0.8; 6 -5.8,0; 7 -5.8,-0.8; 8 -5.8,-1.6; 9 -5.8,-2.4; 10 -5.8,-3.2; 11 -5.8,-4; 23 5.8,-4; 24 5.8,-3.2; 25 5.8,-2.4; 26 5.8,-1.6; 27 5.8,-0.8; 28 5.8,0; 29 5.8,0.8; 30 5.8,1.6; 31 5.8,2.4; 32 5.8,3.2; 33 5.8,4 | smd 0.5 x 1.5: 12 -4,-5.8; 13 -3.2,-5.8; 14 -2.4,-5.8; 15 -1.6,-5.8; 16 -0.8,-5.8; 17 0,-5.8; 18 0.8,-5.8; 19 1.6,-5.8; 20 2.4,-5.8; 21 3.2,-5.8; 22 4,-5.8; 34 4,5.8; 35 3.2,5.8; 36 2.4,5.8; 37 1.6,5.8; 38 0.8,5.8; 39 0,5.8; 40 -0.8,5.8; 41 -1.6,5.8; 42 -2.4,5.8; 43 -3.2,5.8; 44 -4,5.8
TSSOP24 = smd 0.305 x 0.991: 1 -3.575,-2.918; 2 -2.925,-2.918; 3 -2.275,-2.918; 4 -1.625,-2.918; 5 -0.975,-2.918; 6 -0.325,-2.918; 7 0.325,-2.918; 8 0.975,-2.918; 9 1.625,-2.918; 10 2.275,-2.918; 11 2.925,-2.918; 12 3.575,-2.918; 13 3.575,2.918; 14 2.925,2.918; 15 2.275,2.918; 16 1.625,2.918; 17 0.975,2.918; 18 0.325,2.918; 19 -0.325,2.918; 20 -0.975,2.918; 21 -1.625,2.918; 22 -2.275,2.918; 23 -2.925,2.918; 24 -3.575,2.918
SOT23-3 = smd 0.8 x 1: 1 -0.915,-1; 2 0.915,-1; 3 0,1
SOT523-3 = smd 0.4 x 0.51: 1 -0.5,-0.65; 2 0,0.65; 3 0.5,-0.65
SWITCH_SPST_SMD_A = smd 0.7 x 1.5: 1 -2.25,-1.75; 2 -0.75,-1.75; 3 2.25,-1.75 | smd 1 x 0.6: GND1 -3.65,1; GND3 3.65,1 | smd 1 x 0.8: GND2 -3.65,-1.1; GND4 3.65,-1.1 | hole 0.9: -1.5,0; 1.5,0
SOT223-3 = smd 1 x 1.5: 1 -2.3,-3.15; 2 0,-3.15; 3 2.3,-3.15 | smd 3.3 x 1.5: TAB 0,3.15
XBEE-PRO-SMD = smd 2.29 x 0.89: 1 -12.54,9; 2 -9.605,7; 3 -12.54,5; 4 -9.605,3; 5 -12.54,1; 6 -9.605,-1; 7 -12.54,-3; 8 -9.605,-5; 9 -12.54,-7; 10 -9.605,-9; 11 12.395,-9; 12 9.46,-7; 13 12.395,-5; 14 9.46,-3; 15 12.395,-1; 16 9.46,1; 17 12.395,3; 18 9.46,5; 19 12.395,7; 20 9.46,9
CRYSTAL-SMD-5X3.2-4PAD = smd 1.9 x 1.1: 1 -1.85,-1.15; 2 1.85,-1.15; 3 1.85,1.15; 4 -1.85,1.15

### Placement (x,y rotation side)
ACCEL  135.57,9.53 0 top
BARO  72.07,9.53 0 top
BM  105.09,15.56 0 top
C1  29.84,25.4 180 top
C2  29.84,7.62 180 top
C3  62.23,25.4 180 top
C4  62.23,8.26 180 top
C5  88.27,5.71 180 top
C6  123.83,10.79 180 top
C7  107.95,32.7 270 top
C8  110.49,32.7 90 top
C9  113.35,32.7 90 top
C10  92.39,18.1 90 top
C11  83.5,18.1 270 top
C12  79.69,30.16 270 top
C13  79.69,35.88 270 top
C14  81.92,35.88 270 top
C15  93.98,35.88 270 top
C16  125.09,23.5 90 top
C17  17.46,19.05 270 top
C18  21.27,19.05 270 top
C19  25.08,19.05 270 top
CC  123.19,32.7 90 top
D1  127,4.13 0 top
D2  121.92,4.13 0 top
D3  116.52,4.13 0 top
D4  111.44,4.13 0 top
D5  106.05,4.13 0 top
D6  100.97,4.13 0 top
D7  95.89,4.13 0 top
D8  118.43,28.57 90 top
DP0  40.64,28.89 90 top
DPA  40.64,9.53 90 top
DPB  72.39,28.89 90 top
EXT_OAT  99.38,33.66 0 top
EXT_POWER  130.49,32.07 180 top
EXT_SW  130.18,21.59 0 top
F1  130.49,25.72 180 top
F2  130.18,18.1 0 top
ICSP  99.38,25.72 0 top
J1  110.49,19.05 270 bottom
JP1  138.11,26.99 90 top
MCU  87.95,29.21 0 top
MUX  88.27,10.79 270 top
Q1  120.97,24.45 0 top
Q2  124.46,8.57 270 top
Q3  125.41,28.57 270 top
R1  29.84,22.86 180 top
R2  29.84,20.32 180 top
R3  29.84,5.08 180 top
R4  29.84,2.54 180 top
R5  62.23,22.86 180 top
R6  62.23,20.32 180 top
R7  62.23,5.71 180 top
R8  62.23,3.17 180 top
R9  122.56,14.29 270 top
R10  125.09,14.29 270 top
R11  103.19,10.79 0 top
R12  107,10.79 0 top
R13  101.6,15.56 90 top
R14  100.65,36.2 180 top
R15  118.75,31.43 0 top
R16  93.66,22.23 270 top
R17  96.2,22.23 270 top
R18  121.92,6.99 0 top
R19  130.49,34.92 180 top
R20  130.49,36.51 180 top
R21  97.79,11.43 0 top
R22  97.79,13.65 0 top
R23  84.45,21.59 180 top
R24  116.52,6.99 0 top
R25  111.44,6.99 0 top
R26  106.05,6.99 0 top
R27  100.97,6.99 0 top
R28  95.89,6.99 0 top
R29  118.75,33.97 0 top
R30  127,6.99 0 top
S1  137.79,17.46 270 top
U1  121.28,28.57 90 top
U$3  69.85,19.05 0 bottom
VREG  113.03,27.3 90 top
XBEE  24.77,19.05 90 bottom
Y1  87.95,18.1 0 top

### Tracks (layer width: path | path; a pad name or v marks a point on that pad's centre or on a via)
ASSOC_LED  (via drill 0.33)
  Top 0.152: v100.65,2.22 107.63,2.22 108.27,2.86 108.27,6.67 107.95,6.99 R26.2
  Bottom 0.152: XBEE.15 24.45,30.76 24.45,7.94 24.07,7.56 24.07,6.03 25.92,4.18 26.41,4.18 27.36,3.23 31.06,3.23 32.01,2.28 100.59,2.28 v100.65,2.22
BAT+  (via drill 0.33)
  Top 0.381: F2.2 v133.99,18.1 134.1,18.21 | 125.41,33.66 125.41,33.65 CC.3 v126.05,33.66 | C16.+ 126.36,26.16 v126.36,26.35 126.41,26.4 Q3.3 | U1.3 120.33,28.53 v120.33,27.3 | v121.92,16.83 119.05,16.83 113.01,10.79 R12.2 107.68,10.79 106.84,9.95 105.45,9.95 104.61,10.79 R11.2
  Bottom 0.381: v121.92,16.83 133.99,16.83 v133.99,18.1 133.99,19.03 134.04,19.08 134.04,25.03 132.72,26.35 v126.36,26.35 | v126.05,33.66 126.05,26.67 v126.36,26.35 | v120.33,27.3 121.28,26.35 v126.36,26.35
BAT+_UF  (via drill 0.33)
  Top 0.381: F2.1 v127,18.1
  Bottom 0.381: v127,18.1 114.24,18.1 J1.2
BAT-  (via drill 0.33)
  Top 0.381: R13.1 103,15.56 104.78,15.56 | 104.78,15.56 107,15.56 108.9,17.46 108.9,19.37 v109.54,20 | BM.2 104.78,15.56
  Bottom 0.381: v109.54,20 109.58,20.05 J1.1
BAT_LOW
  Top 0.152: U1.2 Q3.1
BM_VDD
  Top 0.305: R12.1 106.15,11.64 106.05,11.75 106.05,12.63 BM.4
BM_VIN
  Top 0.305: R11.1 103.29,11.75 105.09,11.75 105.42,12.07 BM.3
CC_PROG
  Top 0.152: CC.5 120.97,31.75 120.65,31.43 R15.2
EXT_OAT  (via drill 0.33)
  Top 0.152: EXT_OAT.2 101.5,34.08 R14.1 101.5,36.93 101.13,37.3 v98.11,37.3 | MCU.41 86.36,35 86.36,33.97 v87,33.34
  Bottom 0.152: v87,33.34 90.96,37.3 v98.11,37.3
GND  (via drill 0.33, 0.35)
  Top 0.305: v135.57,9.53 134.83,8.78 | 71.57,8.78 BARO.3 | ACCEL.5 134.23,8.58
  other vias: 86.36,21.59 72.71,32.7 1.59,19.05 100.65,24.13 101.92,30.16 97.16,29.21 90.17,21.27 138.11,36.51 138.11,1.59 138.43,25.72 138.43,28.26 126.68,11.75 124.46,6.35 14.29,36.51 26.99,36.51 14.29,1.59 26.99,1.59 52.7,2.86 52.39,36.51 47.31,2.86 47.31,36.51 59.05,36.51 59.05,2.86 65.09,36.51 65.72,2.86 138.11,32.7 138.11,5.4 134.3,1.59 134.3,5.4 134.3,32.7 134.3,36.51 5.4,19.05 1.59,27.94 1.59,10.16 5.4,10.16 5.4,27.94 71.44,37.15 39.69,37.15 86.04,15.24 119.06,12.06 95.25,13.02 113.67,10.48 114.3,16.19 91.76,32.7 92.08,27.3 95.89,32.07 97.16,33.97 86.36,30.8 85.09,29.53 78.74,32.7 76.52,32.7 47.31,19.05 52.7,19.05 60.01,19.05 71.12,16.51 136.21,34.61 136.21,3.49 115.57,22.54 102.55,18.73 100.65,18.73 100.33,11.11 87.95,11.43 87.95,8.26 14.29,19.05 28.26,19.05 14.29,27.94 14.29,10.16 100.65,21.27 107,29.21 113.03,27.3 137.16,26.99 113.03,28.57 113.03,26.04 84.77,33.66 106.68,37.15 103.5,37.15 23.81,27.3 23.81,12.7 127,19.37 120.65,20 130.81,15.24 133.67,15.24 70.8,6.35 132.4,8.89
  pour Top (isolate 0.152): 0,38.1 139.7,38.1 139.7,0 0,0
  pour Bottom: 0,38.1 139.7,38.1 139.7,0 0,0
MISO  (via drill 0.33)
  Top 0.152: 82.67,25.21 MCU.11 83.31,25.21 83.5,25.4 83.5,26.12 84.68,27.3 86.36,27.3 88.27,29.21 v90.17,29.21
  Bottom 0.152: v90.17,29.21 95.89,29.21 ICSP.1
MOSI  (via drill 0.33)
  Top 0.152: MCU.10 82.96,26.01 84.57,27.62 86.04,27.62 86.06,27.64 86.17,27.64 88.7,30.16 v90.81,30.16
  Bottom 0.152: v90.81,30.16 100.01,30.16 ICSP.4
MUX_RST  (via drill 0.33)
  Top 0.152: v87.95,13.02 87.89,13.07 MUX.3 | MCU.25 95.39,26.81 v95.57,26.67 | v99.06,18.73 99.06,18.1 v93.34,12.38
  Bottom 0.152: v93.34,12.38 88.58,12.38 v87.95,13.02 | v95.57,26.67 97.48,24.75 97.48,24 99.06,22.43 v99.06,18.73
MUX_SCL  (via drill 0.33)
  Top 0.152: MCU.18 88.75,22.7 89.53,21.91 92.5,21.91 R16.1 94.72,23.07 v94.93,22.86 | v92.71,13.02 92.66,13.07 MUX.22
  Bottom 0.152: v94.93,22.86 94.93,15.24 v92.71,13.02
MUX_SDA
  Top 0.152: 89.53,24.45 89.55,24.43 MCU.19 89.55,22.53 89.85,22.23 92.09,22.23 92.71,22.85 92.71,23.5 93.07,23.85 95.42,23.85 R17.1 96.2,22.75 96.93,22.02 96.93,17.87 92.78,13.72 MUX.23
N$1
  Top 0.152: R18.2 122.77,4.15 D2.C
N$2
  Top 0.152: R24.1 115.67,5.85 D3.C
N$3
  Top 0.152: R25.1 110.59,5.85 D4.C
N$4  (via drill 0.33)
  Top 0.152: Q2.1 122.74,9.07 v122.24,8.57 121.07,7.41 R18.1 | CC.1 124.49,30.83 v124.14,30.48 | v106.68,26.35 v106.68,21.27 | v117.47,10.79 118.11,10.16 v118.11,8.57
  Bottom 0.152: v124.14,30.48 110.81,30.48 v106.68,26.35 | v106.68,21.27 106.68,14.92 109.86,11.75 116.52,11.75 v117.47,10.79 | v118.11,8.57 v122.24,8.57
N$6
  Top 0.152: C10.2 92.09,19.25 Y1.3 87.95,21.1 MCU.17
N$7
  Top 0.152: C11.2 83.8,16.95 Y1.1 87.28,18.13 87.28,20.53 87.15,20.66 MCU.16
N$8
  Top 0.381: Q1.3 121.97,25.45 123.19,26.67 123.83,26.67 124.41,27.26 Q3.2
N$10
  Top 0.152: R30.2 127.85,4.15 D1.C
N$11
  Top 0.152: Q2.2 125.73,8.57 126.15,8.15 R30.1
N$12
  Top 0.152: C14.2 83.29,33.66 83.29,33.32 83.82,32.79 85.18,32.79 85.55,33.16 MCU.42
N$16
  Top 0.152: C12.2 79.8,29.21 MCU.6
N$20
  Top 0.152: D5.A 105.17,6.96 R26.1
N$21
  Top 0.152: D6.A 100.09,6.96 R27.1
N$22
  Top 0.152: D7.A 95.01,6.96 R28.1
ON_LED  (via drill 0.33)
  Top 0.152: R28.2 97.79,6.99 98.11,6.67 98.11,3.17 97.47,2.54 94.93,2.54 v93.34,0.95
  Bottom 0.152: v93.34,0.95 32.72,0.95 31.18,2.48 25.98,2.48 23.09,5.37 23.09,29.61 21.59,31.11 20.09,31.11 XBEE.13
RSSI_LED  (via drill 0.33, 0.35)
  Top 0.152: v103.19,5.4 103.19,6.67 102.87,6.99 R27.2 | v26.35,3.17 27.3,3.17 27.62,2.86 27.62,0.95 43.18,0.95 v43.81,1.59
  Bottom 0.152: XBEE.6 23.77,5.76 v26.35,3.17 | v43.81,1.59 101.92,1.59 103.19,2.86 v103.19,5.4
RST  (via drill 0.33)
  Top 0.152: v90.81,28.26 87.74,28.26 86.49,27 86.37,27 86.36,26.99 85.41,26.99 84.77,26.35 84.77,23.43 MCU.13 84.75,22.89 83.61,21.74 R23.2
  Bottom 0.152: v90.81,28.26 95.25,28.26 97.79,25.72 97.79,24.13 98.74,23.18 102.87,23.18 104.46,24.77 ICSP.5
RX_LED  (via drill 0.33)
  Top 0.152: MCU.8 81.83,27.29 81.3,27.29 81.17,27.16 81.17,17.57 82.87,15.88 v85.09,15.88 | v110.17,8.26 111.02,8.26 R25.2
  Bottom 0.152: v85.09,15.88 86.36,15.88 87,15.24 87,7.42 88,6.41 107.37,6.41 109.22,8.26 v110.17,8.26
RXD  (via drill 0.33, 0.35)
  Top 0.152: v90.17,25.08 90.35,24.91 MCU.20 | v38.42,26.35 42.32,26.35 43.02,27.05 78.68,27.05 79.69,26.04 v79.69,24.77 | v88.58,26.04 87.63,26.04 87.31,26.35 v85.72,26.35 | v82.55,24.45 82.55,24.13 v81.92,23.5
  Bottom 0.152: XBEE.2 31.77,19.67 31.75,19.68 v38.42,26.35 | v90.17,25.08 89.53,25.08 v88.58,26.04 | v79.69,24.77 80.64,24.77 v81.92,23.5 | v85.72,26.35 83.82,24.45 v82.55,24.45
SCK  (via drill 0.33)
  Top 0.152: MCU.9 83.33,26.81 84.45,27.94 86.04,27.94 89.22,31.11 v90.17,31.11
  Bottom 0.152: v90.17,31.11 102.23,31.11 103.19,30.16 103.19,26.67 102.23,25.72 ICSP.3
SCL_ACCEL  (via drill 0.33, 0.35)
  Top 0.152: MUX.14 91.25,7.94 v92.39,7.94 | v123.83,14.57 124.4,15.14 R10.1 126.15,15.14 v126.68,14.61 | v127.95,14.61 133.53,9.03 ACCEL.4
  Bottom 0.152: v92.39,7.94 93.98,9.53 118.78,9.53 v123.83,14.57 | v127.95,14.61 v126.68,14.61
SCL_BM  (via drill 0.33)
  Top 0.152: BM.6 105.41,17.46 104.78,16.83 v104.46,16.83 | v97.47,14.92 96.94,14.39 R22.1 95.03,11.75 91.2,11.75 MUX.20
  Bottom 0.152: v104.46,16.83 99.38,16.83 v97.47,14.92
SCL_BMP_BARO
  Top 0.152: MUX.11 83.19,7.87 82.94,7.62 73.98,7.62 71.75,5.4 69.85,5.4 69.69,5.56 69.69,7.46 69.53,7.62 | BARO.2 70.48,8.45 70.48,7.62 69.53,7.62 | R8.1 64.05,3.17 68.5,7.62 69.53,7.62
SCL_DP0  (via drill 0.33)
  Top 0.152: MUX.5 84.16,11.77 v84.14,11.75 | v48.26,23.81 45.72,23.81 DP0.P$4 42.23,20.32 R2.1
  Bottom 0.152: v84.14,11.75 81.28,11.75 78.74,14.29 78.74,23.18 78.11,23.81 v48.26,23.81
SCL_DPA  (via drill 0.33)
  Top 0.152: MUX.7 v84.14,10.48 | v48.9,6.35 45.72,3.17 DPA.P$4 42.55,1.27 31.96,1.27 R4.1
  Bottom 0.152: v84.14,10.48 55.56,10.48 51.44,6.35 v48.9,6.35
SCL_DPB
  Top 0.152: MUX.9 81.64,9.17 76.83,13.97 76.83,21.91 DPB.P$4 73.34,19.68 63.72,19.68 R6.1
SDA_ACCEL
  Top 0.152: MUX.13 92.63,7.22 94.61,9.21 114.3,9.21 120.23,15.14 R9.1 | 122.56,15.24 123.83,16.51 126.36,16.51 127.32,15.56 127.32,14.29 131.13,10.48 131.13,7.62 134.57,7.62 ACCEL.6
  Top 0.305: R9.1 122.56,15.24
SDA_BM  (via drill 0.33)
  Top 0.152: BM.5 106.05,18.43 v106.05,16.83 | v97.79,12.38 96.94,11.53 R21.1 96.63,11.12 MUX.19
  Bottom 0.152: v106.05,16.83 101.6,12.38 v97.79,12.38
SDA_BMP_BARO  (via drill 0.35)
  Top 0.152: MUX.10 82.55,8.52 82.28,8.26 72.07,8.26 | BARO.4 72.07,8.26 | v69.22,8.26 68.16,8.26 65.62,5.71 R7.1 | v71.44,7.62 72.07,8.26
  Bottom 0.152: v69.22,8.26 70.8,8.26 v71.44,7.62
SDA_DP0  (via drill 0.33)
  Top 0.152: MUX.4 82.59,12.42 v82.55,12.38 | v50.48,25.4 44.77,25.4 DP0.P$3 40.96,21.59 32.38,21.59 31.11,22.86 R1.1
  Bottom 0.152: v82.55,12.38 79.38,15.56 79.38,23.81 77.79,25.4 v50.48,25.4
SDA_DPA  (via drill 0.33)
  Top 0.152: MUX.6 v82.56,11.12 v82.55,11.11 | v50.48,7.94 46.67,7.94 DPA.P$3 40.64,1.91 36.2,1.91 33.02,5.08 R3.1
  Bottom 0.152: v82.55,11.11 54.61,11.11 51.44,7.94 v50.48,7.94
SDA_DPB
  Top 0.152: MUX.8 81.94,9.82 77.47,14.29 77.47,23.5 76.83,24.13 74.93,24.13 73.66,22.86 DPB.P$3 73.66,20.95 73.03,20.32 68.48,20.32 65.94,22.86 R5.1
SLEEP_RQ  (via drill 0.33)
  Top 0.152: MCU.32 92.73,32.41 92.08,31.75 88.9,31.75 86.04,28.89 v85.72,28.89 | v26.04,10.16 22.23,6.35 v19.05,6.35
  Bottom 0.152: v85.72,28.89 38.1,28.89 29.84,20.64 28.26,20.64 26.99,19.37 26.99,11.11 v26.04,10.16 | v19.05,6.35 18.89,6.51 XBEE.9
TX_LED  (via drill 0.33)
  Top 0.152: MCU.22 91.95,26.48 91.76,26.67 89.22,26.67 v88.58,27.3 | v80.6,26.99 80.6,17.51 82.87,15.24 v84.14,15.24 | v115.25,8.26 116.1,8.26 R24.2
  Bottom 0.152: v88.58,27.3 80.92,27.3 v80.6,26.99 | v84.14,15.24 86.68,12.7 86.68,7.3 88.01,5.97 112.97,5.97 v115.25,8.26
TXD  (via drill 0.33)
  Top 0.152: v91.12,25.72 91.12,23.43 MCU.21
  Bottom 0.152: XBEE.3 29.77,19.61 38.1,27.94 86.04,27.94 88.9,27.94 v91.12,25.72
USB_5V0  (via drill 0.33)
  Top 0.305: R29.2 120.65,33.97 120.97,33.66 CC.4 122.88,33.65 123.19,33.34 123.19,31.43 122.24,30.48 119.18,30.48 D8.A 118.43,29.53 v117.47,28.57 | D2.A 121.04,3.42 121.28,3.17 126.36,3.17 | 126.36,3.17 v128.91,3.17 | D1.A 126.12,3.42 126.36,3.17 | v128.91,15.24 124.78,19.37 v124.46,19.37 124.13,19.37 Q1.1 | F1.2 128.91,25.53 v128.91,23.81
  Bottom 0.305: v128.91,15.24 v128.91,3.17 | v128.91,23.81 v124.46,19.37 120.02,23.81 117.16,23.81 116.2,24.77 116.2,27.3 v117.47,28.57
USB_5V0_UF
  Top 0.381: JP1.1 135.23,25.72 F1.1 131.89,29.71 130.49,31.11 EXT_POWER.1
USB_N  (via drill 0.33)
  Top 0.152: MCU.3 83.68,31.61 v83.82,31.75 | v109.54,36.83 110.24,36.13 110.24,35.96 110.57,35.62 111.04,35.62 111.15,35.73 127.79,35.73 128.59,34.92 R19.2
  Bottom 0.152: v83.82,31.75 84.14,32.07 87.41,32.07 91.85,36.5 108.89,36.5 109.22,36.83 v109.54,36.83
USB_P  (via drill 0.33)
  Top 0.152: MCU.4 84.15,30.81 v84.45,31.11 | v110.81,36.2 111.59,36.2 111.76,36.03 128.1,36.03 128.59,36.51 R20.2
  Bottom 0.152: v84.45,31.11 85.1,31.76 87.54,31.76 91.97,36.2 v110.81,36.2
USB_X_N
  Top 0.152: JP1.2 135.08,26.52 133.92,26.52 132.56,27.88 132.56,34.44 132.08,34.92 R19.1
USB_X_P
  Top 0.152: JP1.3 135.1,26.82 134.05,26.82 132.87,28 132.87,36.04 132.4,36.51 R20.1
VCC_3V3  (via drill 0.33, 0.35)
  Top 0.305: 85.62,23.34 MCU.14 | v86.36,25.4 86.04,25.4 85.55,24.91 MCU.14 | v91.44,15.56 91.18,15.3 MUX.24 89.62,14.37 89.22,13.97 v89.22,10.16 89.22,5.82 C5.1 | 93.96,35.01 MCU.34 91.95,36.07 92.08,36.2 | 93.96,35.01 C15.2 | MCU.24 96.81,26.01 96.84,26.04 | 96.84,26.04 99.06,28.26 ICSP.2 99.38,31.43 | v96.2,25.08 96.84,25.72 96.84,26.04 | v112.08,14.61 111.12,15.56 111.12,22.23 107.95,25.4 C7.+ | 99.38,31.43 EXT_OAT.1 | EXT_OAT.1 98.02,35.01 93.96,35.01 | R14.2 99.69,36.09 99.69,33.97 EXT_OAT.1 | 107.95,30.8 107.31,31.43 C7.+ | MCU.44 83.95,36.01 84.14,36.2 85.03,36.2 | 93.96,35.01 92.78,36.2 92.08,36.2 | 85.03,36.2 92.08,36.2 | 85.03,36.2 v85.09,36.26 | 108.5,31.85 C7.+ | 99.38,31.43 107.82,31.43 C7.+ | C7.+ 109.94,31.3 C8.1 | C17.+ C18.+ C19.+ | C19.+ 25.08,14.92 28.57,11.43 31.11,11.43 | 31.11,11.43 v34.61,11.43 | 115.64,3.73 D3.A 115.64,3.42 115.89,3.17 | D4.A 110.57,3.42 110.81,3.17 115.89,3.17 | 115.89,3.17 118.43,3.17 119.06,3.81 119.06,7.62 120.33,8.89 120.33,12.59 v121.18,13.44 R9.2 R10.2 125.09,10.79 C6.1 v129.86,10.79 | 31.11,7.83 30.91,8.04 | C2.1 30.59,7.73 30.91,8.04 | R2.2 R1.2 30.7,24.56 C1.1 36.51,25.4 DP0.P$2 39.37,22.86 43.18,26.67 57.57,26.67 R5.2 | R7.2 R8.2 61.38,6.55 C4.1 | R2.2 29.21,20.32 | v93.03,10.16 97.79,10.16 98.64,11.01 R21.2 R22.2 | ACCEL.14 136.02,10.98 136.02,11.4 135.04,12.38 v131.44,12.38 | R5.2 R6.2 63.08,18.62 C4.1 | R5.2 63.08,24.56 C3.1 68.26,25.4 DPB.P$2 v71.12,21.27 | 63.18,8.15 C4.1 | 31.11,11.43 31.11,8.26 30.91,8.04 | C2.1 29,5.92 R3.2 R4.2 | C2.1 34.92,7.62 DPA.P$2 | C4.1 67,8.26 69.03,10.29 BARO.10 | v92.08,20.95 92.5,21.38 R16.2 R17.2 v96.2,20 | MCU.14 85.55,21.83 85.36,21.64
  Top 0.305: 85.36,21.64 R23.1 | v71.12,18.73 v75.88,18.73 | v78.11,18.73 v80.01,18.73 | v81.92,18.73 81.92,20 82.23,20.32 85.09,20.32 85.36,20.59 85.36,21.64 | C19.+ 27.75,20.32 R2.2
  Top 0.381: C8.1 C9.1 115.47,31.85 116.18,31.14 VREG.3
  Bottom 0.305: v86.36,25.4 87.63,25.4 v92.08,20.95 92.08,16.19 v91.44,15.56 | 34.86,11.43 v34.61,11.43 34.61,7.35 XBEE.1 | v121.18,13.44 113.25,13.44 v112.08,14.61 | v89.22,10.16 v93.03,10.16 | v129.86,10.79 v131.44,12.38 | v96.2,20 v96.2,25.08 | v71.12,21.27 v71.12,18.73 | v75.88,18.73 v78.11,18.73 | v80.01,18.73 v81.92,18.73
VCC_5V0
  Top 0.305: C13.2 79.69,33.66 | 79.69,33.66 80.94,32.41 MCU.2 | MCU.7 82.1,28.46 79.07,28.46 77.79,29.74 77.79,33.02 78.42,33.66 79.69,33.66
VIN
  Top 0.381: 135.23,19.03 S1.2 135.24,19.02 133.38,19.02 132.72,19.68 132.08,19.68 EXT_SW.1 129.22,21.59 127.32,23.5 121.93,23.5 Q1.2 120.97,24.36 120.97,24.45 120.02,24.45 118.43,26.04 D8.C
VIN_SW  (via drill 0.33)
  Top 0.381: EXT_SW.2 134.59,19.71 S1.1 | v117.79,25.08 116.26,25.08 VREG.1
  Bottom 0.381: EXT_SW.2 129.22,25.08 v117.79,25.08

### Text on the board
tPlace: 3V3 | A5 | GND | Ext. OAT | GND | Ext. / Power | 5V | DP0 | DPb | ICSP | Ext. Switch | Channel 0 | Channel 2 | Battery / Monitor | ON | 2019-08-xx | Airball Sensor v6 | Channel 7 | OFF | Accel | Channel 4 | DPa | Baro | Channel 1 | Channel 3 | On | RSSI | Assoc | Rx | Tx | Chg. | Full | XBee Status | USB | Battery
bPlace: ON | Designed by Jeremy Cole / for Airball.aero / Reno, Nevada, USA | OFF